# EAGLE design turbo2 (EAGLE 7.6.0)
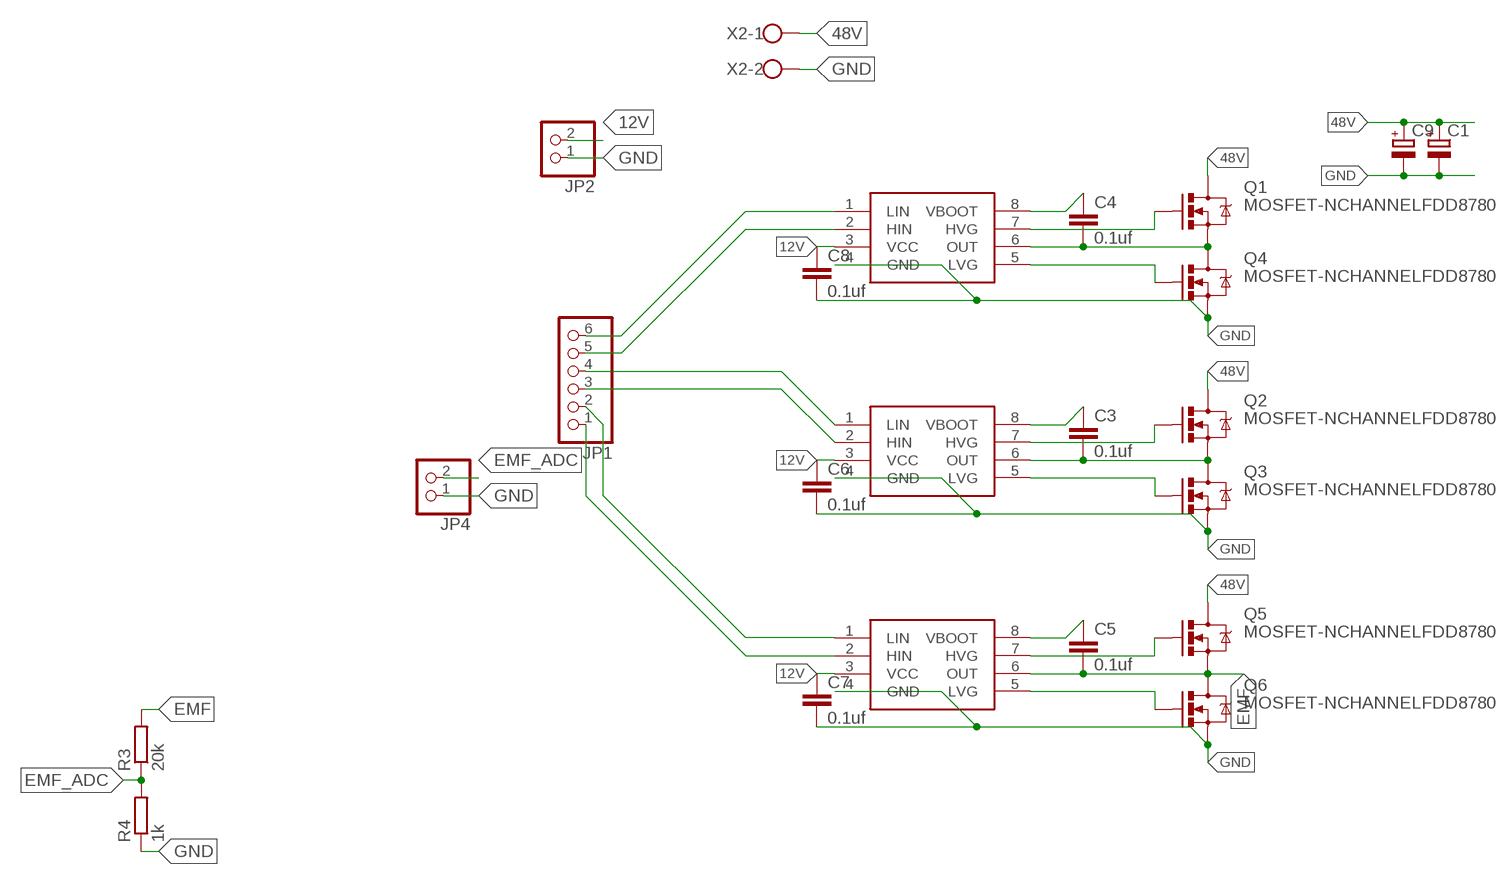
[diagram p0: schematic, sheet 1]

## Parts
C1  CPOL-EUE5-8.5  [E5-8,5]
C3  0.1uf  C-EUC0603  [C0603]
C4  0.1uf  C-EUC0603  [C0603]
C5  0.1uf  C-EUC0603  [C0603]
C6  0.1uf  C-EUC0603  [C0603]
C7  0.1uf  C-EUC0603  [C0603]
C8  0.1uf  C-EUC0603  [C0603]
C9  CPOL-EUE5-8.5  [E5-8,5]
JP1  PINHD-1X6  [1X06]
JP2  PINHD-1X2  [1X02]
JP4  PINHD-1X2  [1X02]
Q1  MOSFET-NCHANNELFDD8780  [DPAK]
Q2  MOSFET-NCHANNELFDD8780  [DPAK]
Q3  MOSFET-NCHANNELFDD8780  [DPAK]
Q4  MOSFET-NCHANNELFDD8780  [DPAK]
Q5  MOSFET-NCHANNELFDD8780  [DPAK]
Q6  MOSFET-NCHANNELFDD8780  [DPAK]
R3  20k  R-EU_R0603  [R0603]
R4  1k  R-EU_R0603  [R0603]
U$1  L6387  [SOIC8]
U$2  L6387  [SOIC8]
U$3  L6387  [SOIC8]
X2  W237-102  [W237-102]

## Nets
12V: C6.1 C7.1 C8.1 JP2.2 U$1.3(VCC) U$2.3(VCC) U$3.3(VCC)
48V: C1.+ C9.+ Q1.4(D) Q2.4(D) Q5.4(D) X2.1
EMF: C5.2 Q5.3(S) Q6.4(D) R3.2 U$3.6(OUT)
EMF_ADC: JP4.2 R3.1 R4.2
GND: C1.- C6.2 C7.2 C8.2 C9.- JP2.1 JP4.1 Q3.3(S) Q4.3(S) Q6.3(S) R4.1 U$1.4(GND) U$2.4(GND) U$3.4(GND) X2.2
N$1: C4.2 Q1.3(S) Q4.4(D) U$1.6(OUT)
N$2: C3.2 Q2.3(S) Q3.4(D) U$2.6(OUT)
N$3: Q3.1(G) U$2.5(LVG)
N$4: Q4.1(G) U$1.5(LVG)
N$5: Q1.1(G) U$1.7(HVG)
N$6: JP1.4 U$2.1(LIN)
N$7: C5.1 U$3.8(VBOOT)
N$8: Q2.1(G) U$2.7(HVG)
N$9: JP1.3 U$2.2(HIN)
N$10: Q6.1(G) U$3.5(LVG)
N$11: Q5.1(G) U$3.7(HVG)
N$12: C3.1 U$2.8(VBOOT)
N$13: C4.1 U$1.8(VBOOT)
N$14: JP1.1 U$3.2(HIN)
N$15: JP1.2 U$3.1(LIN)
N$19: JP1.6 U$1.1(LIN)
N$22: JP1.5 U$1.2(HIN)

## Library data of the parts
C1 C9 = rcl:CPOL-EU: POLARIZED CAPACITOR, European symbol
C3-C8 = rcl:C-EU: CAPACITOR, European symbol
JP1 = pinhead:PINHD-1X6: PIN HEADER
JP2 JP4 = pinhead:PINHD-1X2: PIN HEADER
Q1-Q6 = SparkFun-DiscreteSemi:MOSFET-NCHANNEL: Common NMOSFET Parts MFG P/N Store ID Prod ID FDD8780 TRANS-09984 SI7820DN TRANS-11055 FDS6630A IC-08089 2N7002PW TRANS-11151 FQP30N06L COM-10213 TRANS-10060 BSS123LT1G TRANS-08345 BSS138 TRANS-00830 BS170 2N7000; PROD_ID: TRANS-09984
R3 R4 = rcl:R-EU_: RESISTOR, European symbol
U$1-U$3 = TheLibrary:L6387
X2 = con-wago-500:W237-102: WAGO SCREW CLAMP; MPN: 237-102; OC_FARNELL: unknown; OC_NEWARK: 70K9898

## Net classes
0 default: width 0.381 mm

## Board
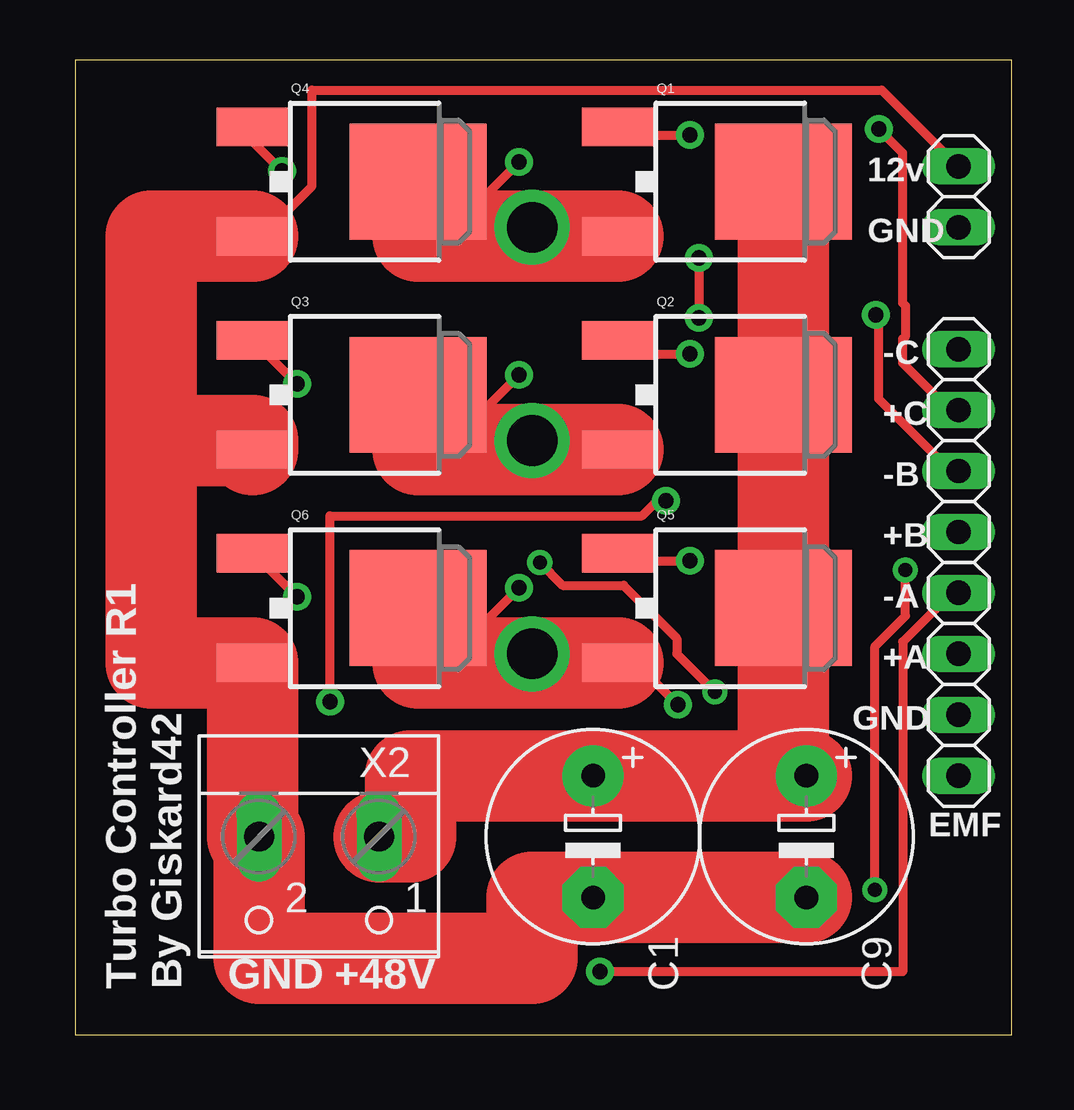
[diagram p1: board, top side]
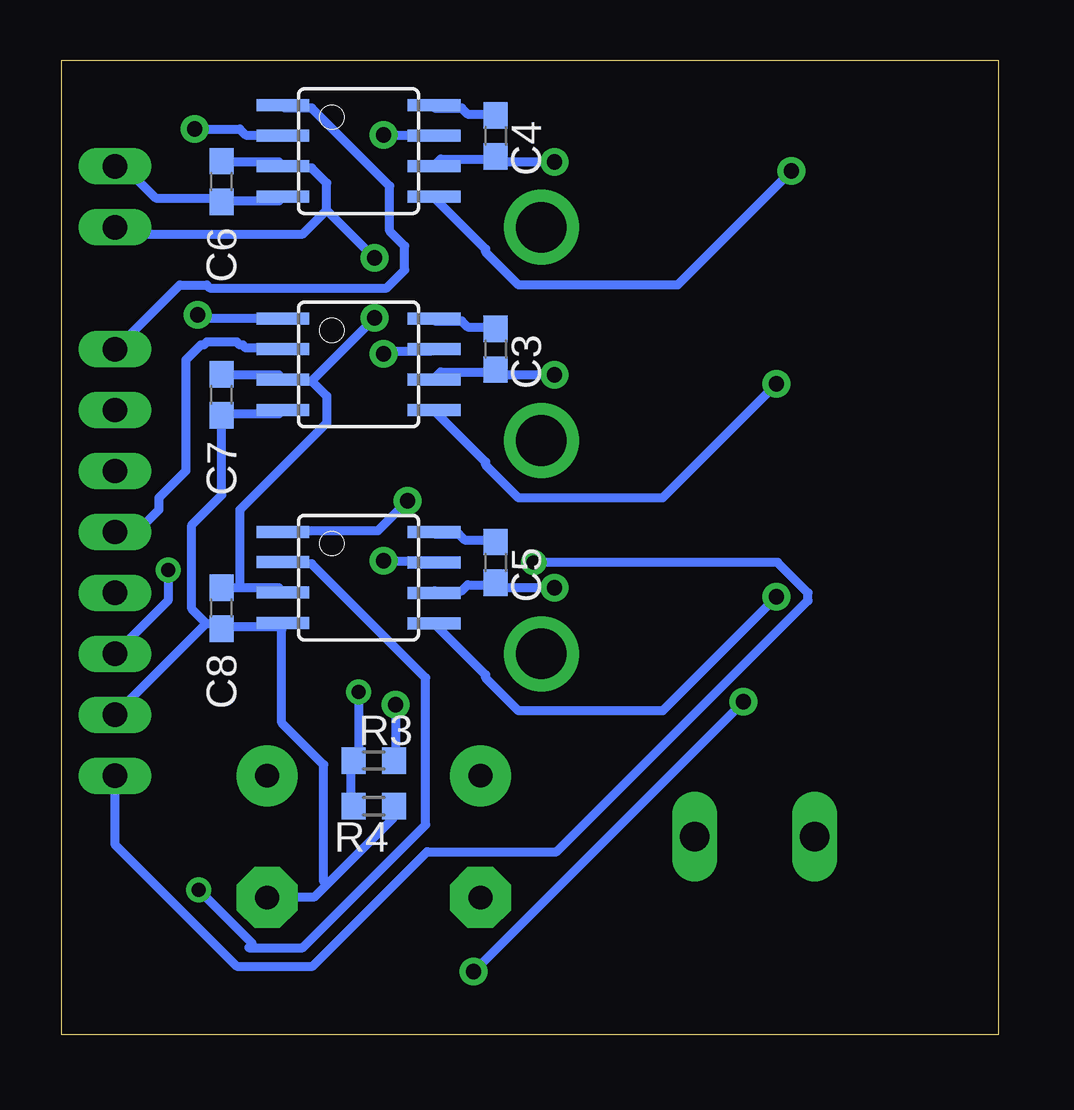
[diagram p2: board, bottom side, seen from below]

Size 39.04 x 40.63 mm. Coordinates in mm from the lower left corner, seen from the top.
Outline: 0,0 39.04,0 39.04,40.63 0,40.63 0,0
Copper layers (1*16): Top 0.035mm / dielectric 1.5mm / Bottom 0.035mm
Design rules "default *": minimum track width 15mil, minimum drill 23mil, track to track 10mil, track to pad 10mil, pad to pad 10mil, via to via 10mil, smd to smd 10mil, copper to edge 40mil, drill to drill 13mil, minimum pad ring 10mil, minimum via ring 8mil, stop-mask expansion 4mil, vias tented up to drill 0mil, thermal gap 10mil

### Footprints (pad centres in the part's own frame; a part is rotated, then mirrored left to right if it is on the bottom)
E5-8,5 = drill 0.991 pad 2.54: + -2.54,0 | drill 0.991 pad 2.54 octagon: - 2.54,0
C0603 = smd 1.1 x 1: 1 -0.85,0; 2 0.85,0
1X06 = drill 1.016 long: 1 -6.35,0; 2 -3.81,0; 3 -1.27,0; 4 1.27,0; 5 3.81,0; 6 6.35,0
1X02 = drill 1.016 long: 1 -1.27,0; 2 1.27,0
DPAK = smd 1.6 x 3: 1 -2.28,-5.31; 3 2.28,-5.31 | smd 4.826 x 5.715: 4 0,1.588
R0603 = smd 1 x 1.1: 1 -0.85,0; 2 0.85,0
SOIC8 = smd 0.5 x 2.2: 1 -1.905,-3.154; 2 -0.645,-3.154; 3 0.625,-3.154; 4 1.895,-3.154; 5 1.905,3.154; 6 0.635,3.154; 7 -0.635,3.154; 8 -1.905,3.154
W237-102 = drill 1.245 long: 1 -2.5,-1.27; 2 2.5,-1.27

### Placement (x,y rotation side)
C1  21.59,8.25 270 top
C3  20.95,28.58 270 bottom
C4  20.95,37.47 270 bottom
C5  20.95,19.69 270 bottom
C6  32.38,35.56 270 bottom
C7  32.38,26.67 270 bottom
C8  32.38,17.78 270 bottom
C9  30.48,8.25 270 top
JP1  36.83,22.23 90 top
JP2  36.83,34.92 270 top
JP4  36.83,12.07 270 top
Q1  27.94,35.56 270 top
Q2  27.94,26.67 270 top
Q3  12.7,26.67 270 top
Q4  12.7,35.56 270 top
Q5  27.94,17.78 270 top
Q6  12.7,17.78 270 top
R3  26.04,11.43 0 bottom
R4  26.04,9.52 180 bottom
U$1  26.67,36.83 270 bottom
U$2  26.67,27.94 270 bottom
U$3  26.67,19.05 270 bottom
X2  10.16,6.98 180 top

### Tracks (layer width: path | path; a pad name or v marks a point on that pad's centre or on a via)
12V  (via drill 0.64)
  Top 0.381: v26,32.38 v26,29.88
  Bottom 0.381: 31.62,18.62 30,18.62 29.88,18.5 U$3.3 | 31.62,18.62 C8.1 | C7.1 32.38,27.5 30,27.5 29.88,27.38 U$2.3 29.75,27.25 28.62,27.25 | 31.62,18.62 31.62,21.88 28,25.5 28,26.62 28.62,27.25 | C6.1 32.38,36.38 30,36.38 29.88,36.25 U$1.3 29.75,36.12 28.62,36.12 28,35.5 28,34.38 | 28,34.38 29,33.38 36.5,33.38 36.75,33.62 JP2.2 | v26,29.88 28.62,27.25 | 28,34.38 v26,32.38
48V
  Top 3.81: Q1.4 Q2.4 Q5.4 29.53,10.8 C9.+ C1.+ 13.97,10.8 13.97,8.25 X2.1
EMF  (via drill 0.64)
  Top 0.381: v25.12,13.75 24.25,14.62 Q5.3 | v18.5,18.62 17.25,17.38 17.25,15.5
  Top 3.81: Q5.3 17.25,15.5 14.29,15.5 Q6.4
  Bottom 0.381: U$3.6 23.5,18.5 22.38,18.5 22.12,18.75 21,18.75 C5.2 20.88,18.62 v18.5,18.62 | v25.12,13.75 25.12,11.5 R3.2
EMF_ADC  (via drill 0.58)
  Top 0.381: v26.67,14.29 25.08,15.88 25.08,16.51 22.86,18.73 20.32,18.73 v19.37,19.69
  Bottom 0.381: R4.2 27,9.62 27,11.38 R3.1 26.67,11.43 v26.67,14.29 | v19.37,19.69 9.21,19.69 7.94,18.41 7.94,18.1 18.41,7.62 23.81,7.62 28.57,2.86 31.75,2.86 36.83,7.94 JP4.2
GND
  Top 0.381: JP2.1 36.75,36.25 33.62,39.38 9.88,39.38 9.88,35.38 8.88,34.38 Q4.3
  Top 3.81: C9.- C1.- 19.05,5.71 19.05,3.18 7.66,3.18 X2.2 7.39,8.25 Q6.3 3.17,15.5 3.17,24.77 | 3.17,24.77 7.39,24.77 Q3.3 | Q4.3 3.17,33.28 3.17,24.77
  Bottom 0.381: U$1.4 29.88,34.88 30,34.75 32.38,34.75 C6.2 32.5,34.88 35.12,34.88 36.38,36.12 36.75,36.12 JP2.1 | U$2.4 29.88,26 30,25.88 32.38,25.88 C7.2 32.38,25.62 32.38,22.5 33.62,21.25 33.62,17.75 33.02,17.15 | 30,17 32.38,17 C8.2 32.5,17.12 33,17.12 33.02,17.15 | 30,17 29.88,17.12 U$3.4 | 28,6.25 28.5,5.75 30.38,5.75 C9.- | 28,6.25 25.25,9 25.25,9.5 R4.1 | 30,17 29.88,16.88 29.88,13 28.12,11.25 28.12,6.38 28,6.25 | 33.02,17.15 JP4.1
N$1  (via drill 0.64)
  Top 0.381: v18.5,36.38 17.25,35.12 17.25,33.28
  Top 3.81: Q1.3 17.25,33.28 14.29,33.28 Q4.4
  Bottom 0.381: U$1.6 23.5,36.25 23.25,36.5 21,36.5 C4.2 20.88,36.38 v18.5,36.38
N$2  (via drill 0.64)
  Top 0.381: v18.5,27.5 17.25,26.25 17.25,24.39
  Top 3.81: Q2.3 17.25,24.39 14.29,24.39 Q3.4
  Bottom 0.381: U$2.6 23.5,27.38 23.25,27.62 21,27.62 C3.2 20.88,27.5 v18.5,27.5
N$3  (via drill 0.64)
  Top 0.381: v9.25,27.12 7.5,28.88 Q3.1
  Bottom 0.381: v9.25,27.12 14,22.38 20,22.38 21.38,23.75 21.38,23.88 23.5,26 U$2.5
N$4  (via drill 0.64)
  Top 0.381: v8.62,36 7.5,37.12 7.5,37.75 Q4.1
  Bottom 0.381: v8.62,36 13.38,31.25 20,31.25 21.38,32.62 21.38,32.75 23.5,34.88 U$1.5
N$5  (via drill 0.64)
  Top 0.381: v25.62,37.5 22.75,37.5 22.75,37.75 Q1.1
  Bottom 0.381: v25.62,37.5 23.62,37.5 U$1.7
N$6  (via drill 0.64)
  Top 0.381: v33.38,30 33.5,29.88 33.5,26.5 36.5,23.5 36.75,23.5 JP1.4
  Bottom 0.381: v33.38,30 33.25,29.88 29.88,29.88 U$2.1
N$7
  Bottom 0.381: C5.1 21,20.62 22.25,20.62 22.5,20.88 23.5,20.88 U$3.8
N$8  (via drill 0.64)
  Top 0.381: v25.62,28.38 22.75,28.38 22.75,28.88 Q2.1
  Bottom 0.381: v25.62,28.38 25.5,28.5 23.62,28.5 U$2.7
N$9
  Bottom 0.381: JP1.3 36.75,21 35.88,21 35,21.88 35,22.38 33.88,23.5 33.88,28.12 33.25,28.75 33.12,28.75 33,28.88 31.75,28.88 31.62,28.75 31.5,28.75 31.38,28.62 29.88,28.62 U$2.2
N$10  (via drill 0.64)
  Top 0.381: v9.25,18.25 7.5,20 Q6.1
  Bottom 0.381: v9.25,18.25 14,13.5 20,13.5 21.38,14.88 21.38,15 23.5,17.12 U$3.5
N$11  (via drill 0.64)
  Top 0.381: v25.62,19.75 22.75,19.75 22.75,20 Q5.1
  Bottom 0.381: v25.62,19.75 23.62,19.75 U$3.7
N$12
  Bottom 0.381: C3.1 21,29.5 22.12,29.5 22.38,29.75 23.5,29.75 U$2.8
N$13
  Bottom 0.381: C4.1 21,38.38 22.12,38.38 22.38,38.62 23.5,38.62 U$1.8
N$14  (via drill 0.58)
  Top 0.381: v34.61,19.37 34.61,17.46 33.34,16.19 v33.34,6.03
  Bottom 0.381: 31.25,3.62 31.11,3.62 | 31.11,3.62 29,3.62 23.88,8.75 23.88,14.88 28.62,19.62 29.75,19.62 U$3.2 | 36.75,15.88 JP1.1 34.61,18.1 v34.61,19.37 | v33.34,6.03 31.11,3.81 31.11,3.62
N$15  (via drill 0.64)
  Top 0.381: v24.62,22.25 24.25,22.25 23.62,21.62 10.62,21.62 v10.62,13.88 | v21.88,2.62 34.5,2.62 34.5,16.38 36.5,18.38 36.75,18.38 JP1.2
  Bottom 0.381: v24.62,22.25 25.88,21 29.75,21 U$3.1 | v21.88,2.62 v10.62,13.88
N$16  (via drill 2.11)
  other vias: 19.05,24.77
N$17  (via drill 2.11)
  other vias: 19.05,33.66
N$18  (via drill 2.11)
  other vias: 19.05,15.88
N$19
  Bottom 0.381: U$1.1 29.75,38.62 28.62,38.62 25.38,35.38 25.38,33.5 24.75,32.88 24.75,31.88 25.5,31.12 32.88,31.12 33,31.25 34.12,31.25 36.75,28.62 JP1.6
N$22  (via drill 0.64)
  Top 0.381: v33.5,37.75 34.5,36.75 34.5,30.5 34.62,30.38 34.62,29.12 34.5,29 34.5,28 36.38,26.12 36.75,26.12 JP1.5
  Bottom 0.381: v33.5,37.75 31.62,37.75 31.38,37.5 29.88,37.5 U$1.2

### Text on the board
tPlace: 12v | GND | -C | +C | -B | +B | -A | +A | GND | EMF | Turbo Controller R1 | By Giskard42 | GND | +48V